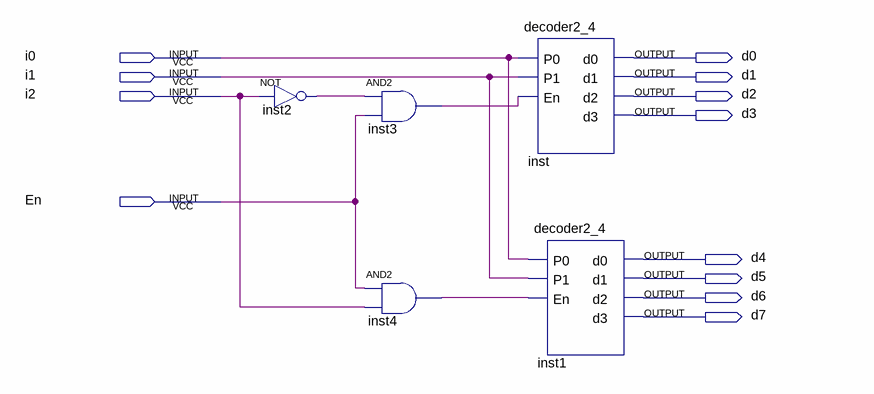
[diagram p0: schematic sheet]
// Quartus schematic decoder3_8.bdf as structural Verilog: 5 symbols, 12 pins
module decoder3_8 (
  input  i0,
  input  i1,
  input  i2,
  input  En,
  output d0,
  output d1,
  output d2,
  output d3,
  output d4,
  output d5,
  output d6,
  output d7
);

  wire inst2_out, inst3_out, inst4_out;

  not inst2 (inst2_out, i2);
  and inst3 (inst3_out, inst2_out, En);
  and inst4 (inst4_out, En, i2);
  decoder2_4 inst (.P0(i0), .P1(i1), .En(inst3_out), .d0(d0), .d1(d1), .d2(d2), .d3(d3));
  decoder2_4 inst1 (.P0(i0), .P1(i1), .En(inst4_out), .d0(d4), .d1(d5), .d2(d6), .d3(d7));
endmodule
